# EAGLE design untitled (EAGLE 7.2.0)

## Sheet 1 of 2
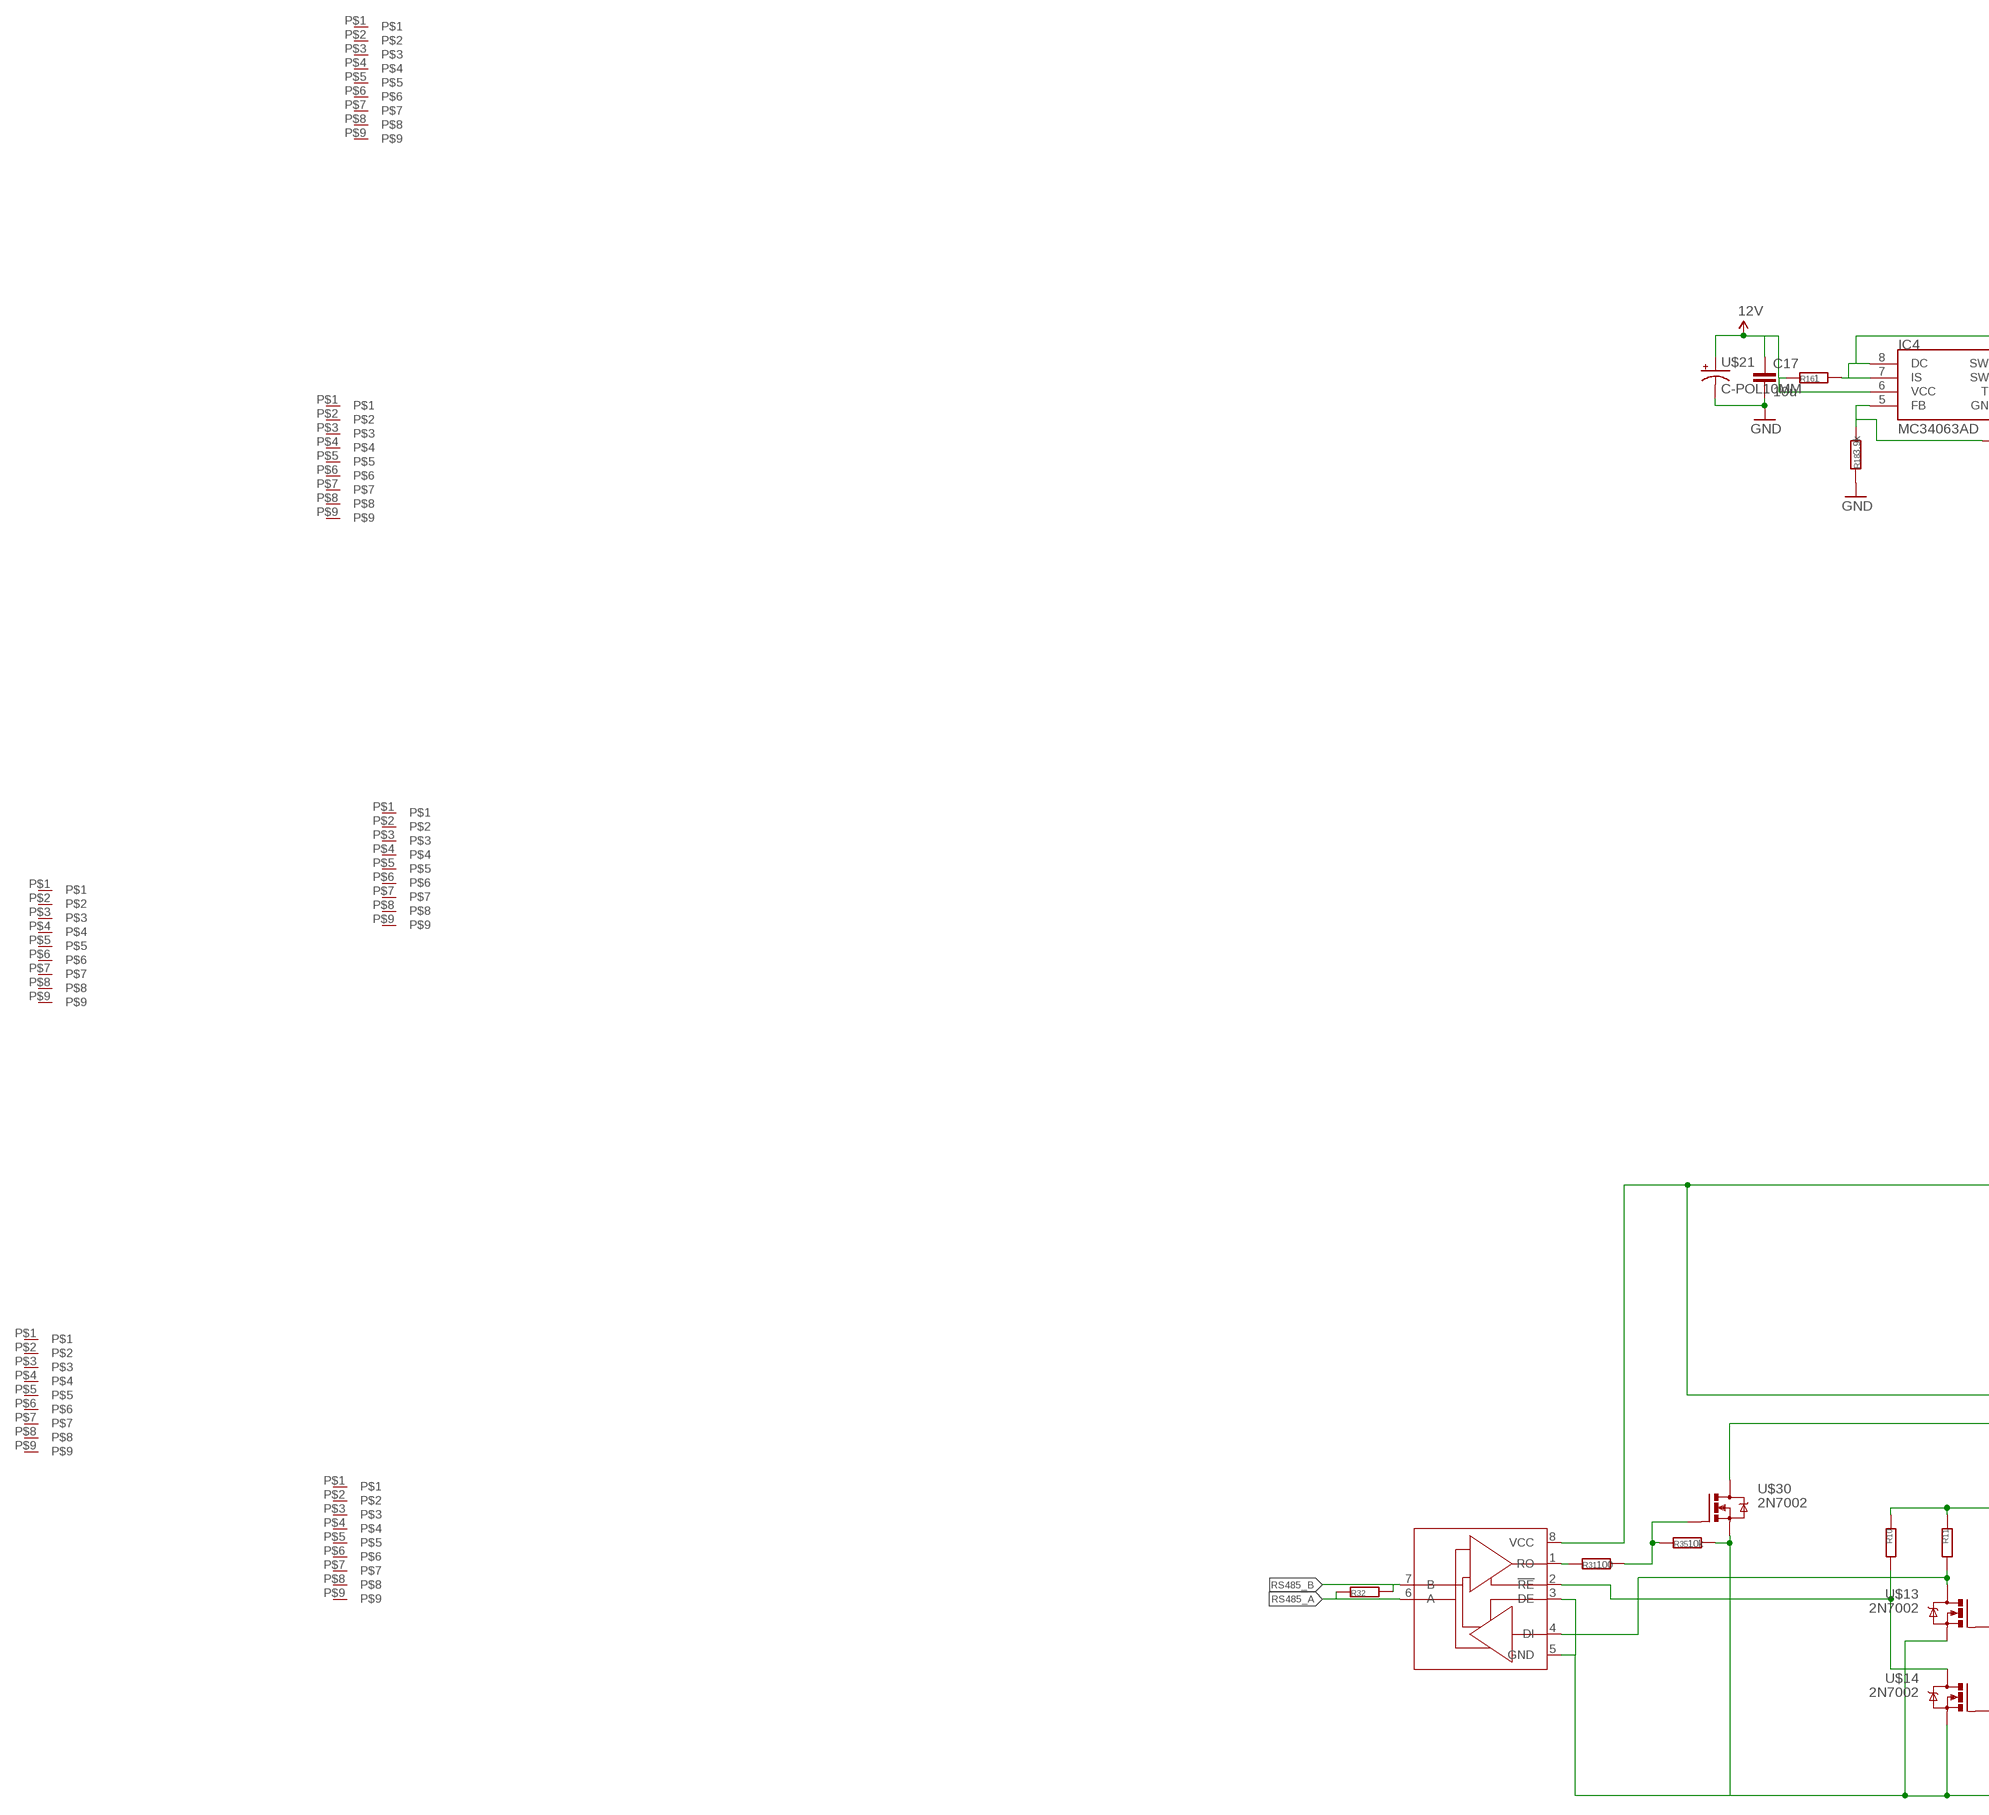
[diagram p0: schematic, sheet 1, part 1 of 2]
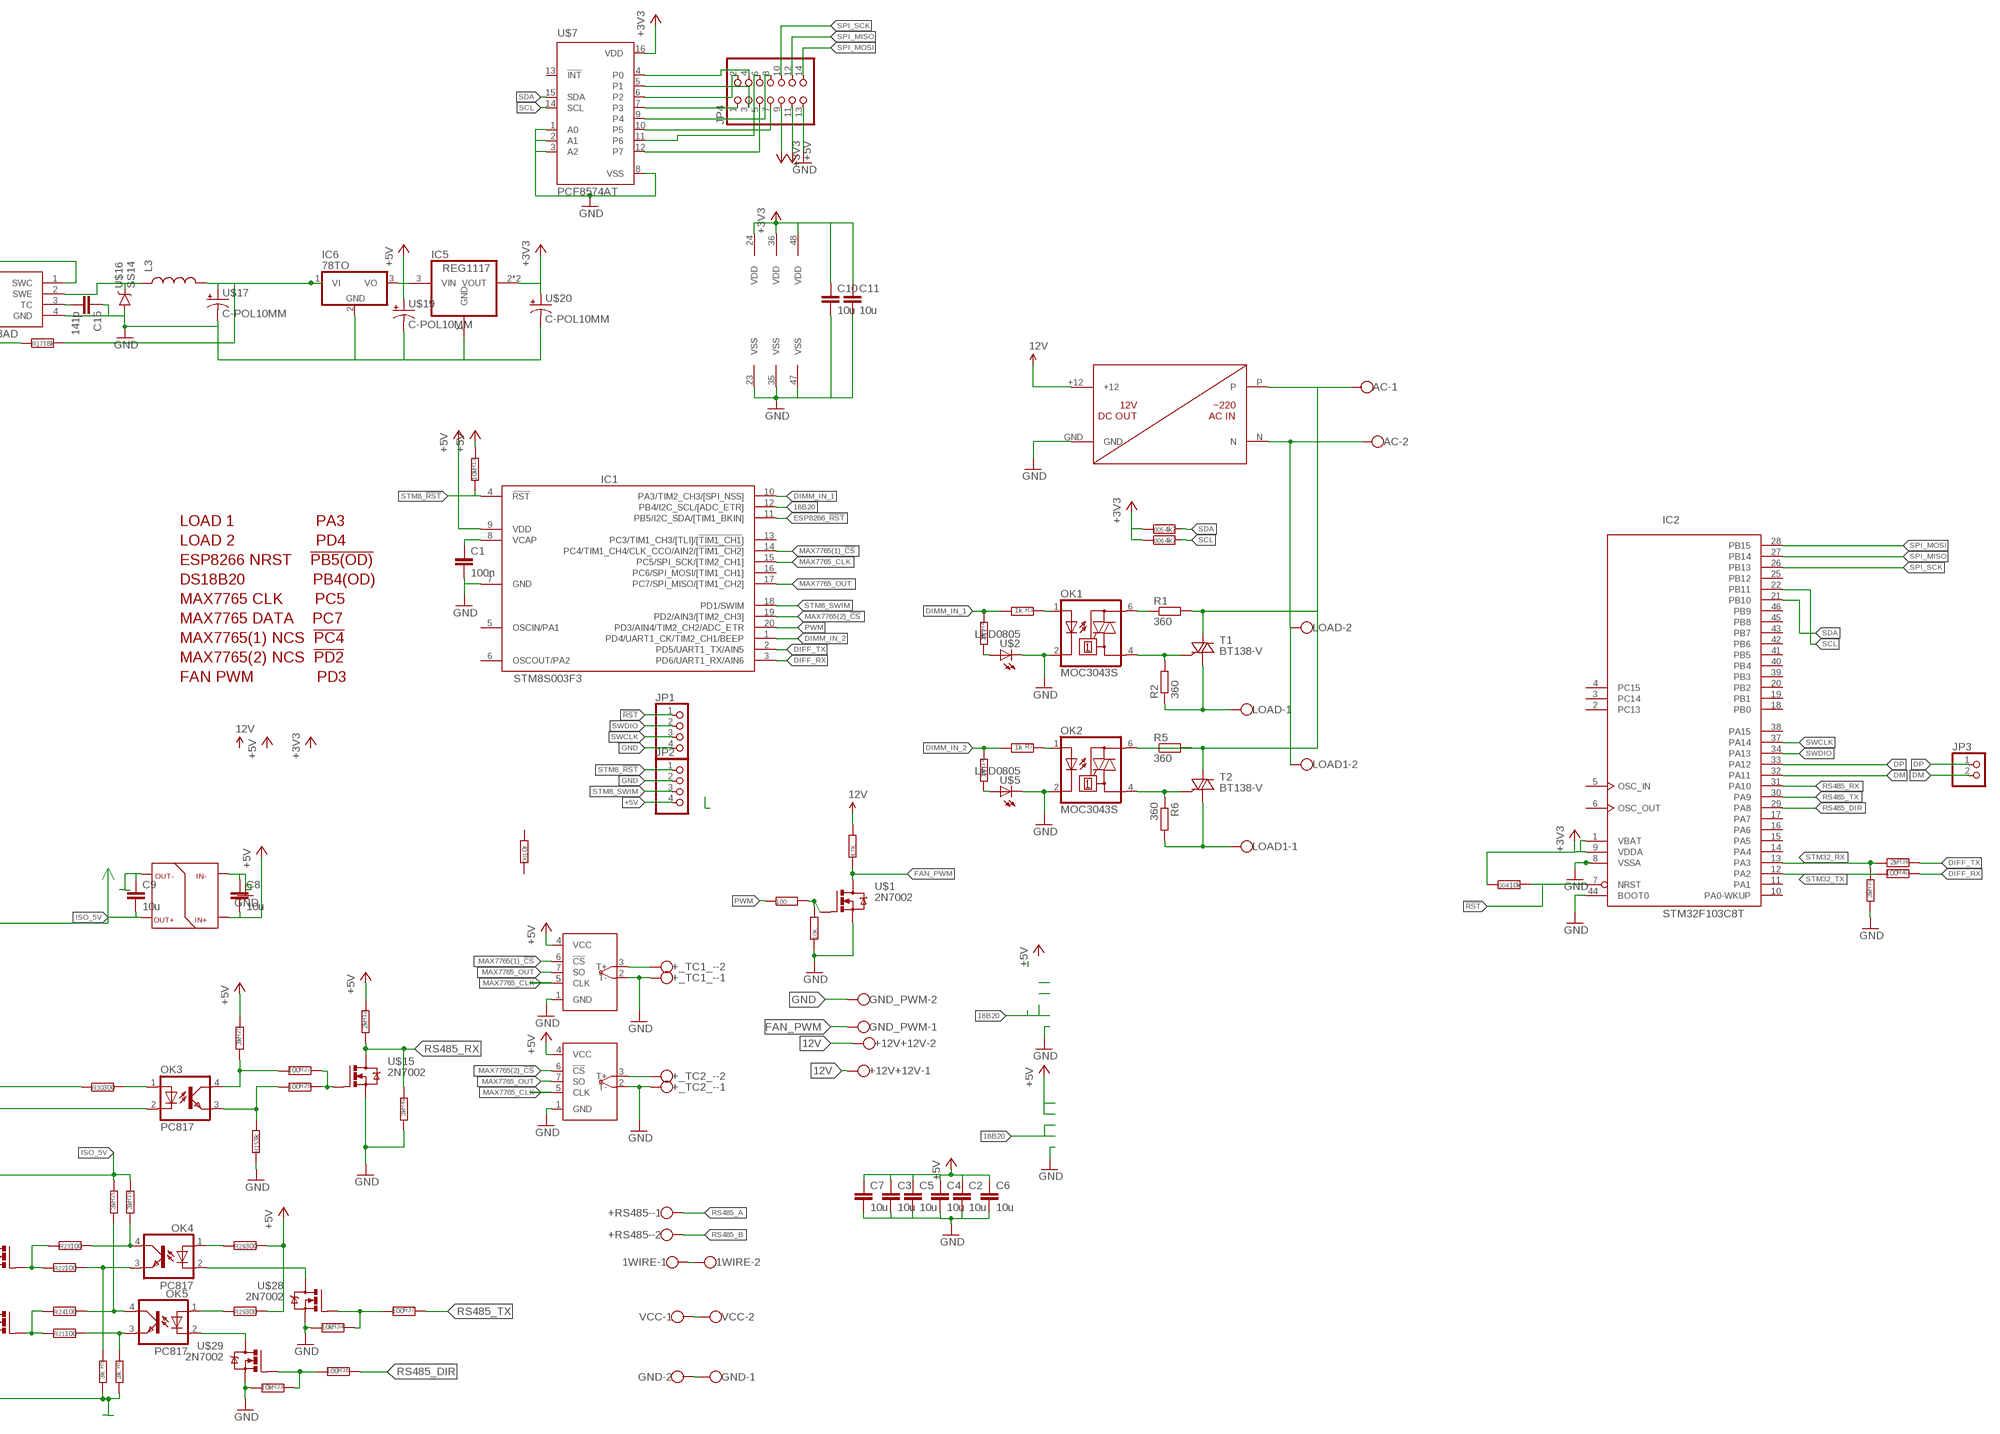
[diagram p1: schematic, sheet 1, part 2 of 2]

### Parts
001  0r  R0603  [0603]
1WIRE  W237-102  [W237-102]
004  10k  R0603  [0603]
4.7K  R0603  [0603]
005  4k7  R0603  [0603]
006  4k7  R0603  [0603]
10K  R0603  [0603]
100  R0603  [0603]
+12V+12V  W237-102  [W237-102]
+_TC1_-  W237-102  [W237-102]
+_TC2_-  W237-102  [W237-102]
+RS485-  W237-102  [W237-102]
AC  W237-102  [W237-102]
C1  100n  CC0603  [C0603]
C2  10u  CC0805  [C0805]
C3  10u  CC0805  [C0805]
C4  10u  CC0805  [C0805]
C5  10u  CC0805  [C0805]
C6  10u  CC0805  [C0805]
C7  10u  CC0805  [C0805]
C8  10u  CC0805  [C0805]
C9  10u  CC0805  [C0805]
C10  10u  CC0603  [C0603]
C11  10u  CC0603  [C0603]
C15  141p  CC0603  [C0603]
C17  10u  CC0805  [C0805]
GND  W237-102  [W237-102]
GND_PWM  W237-102  [W237-102]
IC1  STM8S003F3  [TSSOP20]
IC2  STM32F103C8T  [LQFP48]
IC4  MC34063AD  [SOIC8]
IC5  REG1117  [SOT223]
IC6  78TO  [D2PACK]
JP1  PINHD-1X4  [1X04]
JP2  PINHD-1X4  [1X04]
JP3  PINHD-1X02_2.00  [1X02M]
JP4  PINHD-2X07_2.54-SMD  [2X07SMD]
L3  INDUCTORSRU1038  [SRU1038]
LOAD  W237-102  [W237-102]
LOAD1  W237-102  [W237-102]
OK1  MOC3043S  [DIL6-SMD]
OK2  MOC3043S  [DIL6-SMD]
OK3  PC817  [DIL4-SMD]
OK4  PC817  [DIL4-SMD]
OK5  PC817  [DIL4-SMD]
R1  360  R-EU_0207/5V  [0207/5V]
R2  360  R-EU_0207/5V  [0207/5V]
R3  1k  R0603  [0603]
R4  1k  R0603  [0603]
R5  360  R-EU_0207/5V  [0207/5V]
R6  360  R-EU_0207/5V  [0207/5V]
R7  1k  R0603  [0603]
R8  3k  R0603  [0603]
R9  3k  R0603  [0603]
R10  R0603  [0603]
R11  R0603  [0603]
R12  2k  R0603  [0603]
R13  10k  R0603  [0603]
R14  1k  R0603  [0603]
R15  3k  R0603  [0603]
R16  1  R0805  [R0805]
R17  18k  R0603  [0603]
R18  3.9k  R0603  [0603]
R19  3k  R0603  [0603]
R20  3k  R0603  [0603]
R21  100  R0603  [0603]
R22  100  R0603  [0603]
R23  100  R0603  [0603]
R24  100  R0603  [0603]
R25  3k  R0603  [0603]
R26  100  R0603  [0603]
R27  100  R0603  [0603]
R28  300  R0603  [0603]
R29  300  R0603  [0603]
R30  300  R0603  [0603]
R31  100  R0603  [0603]
R32  R0805  [R0805]
R33  10k  R0603  [0603]
R34  10k  R0603  [0603]
R35  10k  R0603  [0603]
R36  100  R0603  [0603]
R37  100  R0603  [0603]
R38  2k  R0603  [0603]
R39  3k  R0603  [0603]
R40  100  R0603  [0603]
R41  3k  R0603  [0603]
T1  BT138-V  [TO220BV]
T2  BT138-V  [TO220BV]
U$1  2N7002  [SOT23]
U$2  LED0805  [0805-LED]
U$3  MAX6675  [SO08]
U$4  ADM1485  [SO08]
U$5  LED0805  [0805-LED]
U$6  MAX6675  [SO08]
U$7  PCF8574AT  [SO16L]
U$8  AC-DC  [ACDC12(1)]
U$12  DCDC5050  [DCDC/0505]
U$13  2N7002  [SOT23]
U$14  2N7002  [SOT23]
U$15  2N7002  [SOT23]
U$16  SS14  [SMA-DIODE]
U$17  C-POL10MM  [PCAP10]
U$19  C-POL10MM  [PCAP10]
U$20  C-POL10MM  [PCAP10]
U$21  C-POL10MM  [PCAP10]
U$22  D9MG  [D9MG]
U$23  D9MG  [D9MG]
U$24  D9MG  [D9MG]
U$25  D9MG  [D9MG]
U$26  D9MG  [D9MG]
U$27  D9MG  [D9MG]
U$28  2N7002  [SOT23]
U$29  2N7002  [SOT23]
U$30  2N7002  [SOT23]
VCC  W237-102  [W237-102]

### Nets
12V: 4.7K.2 +12V+12V.1 +12V+12V.2 C17.1 IC4.6(VCC) R16.1 U$8.+12 U$21.P$1(+)
18B20: 1WIRE.1 1WIRE.2 IC1.12(PB4/I2C_SCL/[ADC_ETR])
!RST: 004.2 IC2.7(NRST) JP1.1
+3V3: 004.1 005.1 006.1 C10.1 C11.1 IC2.1(VBAT) IC2.9(VDDA) IC2.24(VDD) IC2.36(VDD) IC2.48(VDD) IC5.2(VOUT) IC5.4(VOUT) JP4.9 U$7.16(VDD) U$20.P$1(+)
+5V: C2.1 C3.1 C4.1 C5.1 C6.1 C7.1 C8.2 IC1.9(VDD) IC5.3(VIN) IC6.3(VO) JP2.4 JP4.11 R12.1 R13.1 R25.1 R28.2 R29.2 U$3.4(VCC) U$6.4(VCC) U$12.P$2(IN+) U$19.P$1(+) VCC.1 VCC.2
+7V: IC6.1(VI) L3.2 R17.2 U$17.P$1(+)
DIFF_RX: IC1.3(PD6/UART1_RX/AIN6) R40.1
DIFF_TX: IC1.2(PD5/UART1_TX/AIN5) R38.1
DIMM_IN_1: IC1.10(PA3/TIM2_CH3/[SPI_NSS]) R3.2 R4.1
DIMM_IN_2: IC1.1(PD4/UART1_CK/TIM2_CH1/BEEP) R7.2 R14.1
DM: IC2.32(PA11) JP3.2
DP: IC2.33(PA12) JP3.1
ESP8266_!RST: IC1.11(PB5/I2C_SDA/[TIM1_BKIN])
FAN_PWM: 4.7K.1 GND_PWM.1 U$1.3(D)
GND: 10K.1 +_TC1_-.1 +_TC2_-.1 C1.2 C2.2 C3.2 C4.2 C5.2 C6.2 C7.2 C8.1 C10.2 C11.2 C15.1 C17.2 GND.1 GND.2 GND_PWM.2 IC1.7(GND) IC2.8(VSSA) IC2.23(VSS) IC2.35(VSS) IC2.44(BOOT0) IC2.47(VSS) IC4.4(GND) IC5.1(GND) IC6.2(GND) JP1.4 JP2.2 JP4.13 OK1.2(C) OK2.2(C) R15.1 R18.1 R33.2 R34.2 R39.2 R41.2 U$1.2(S) U$2.C U$3.1(GND) U$3.2(T-) U$5.C U$6.1(GND) U$6.2(T-) U$7.1(A0) U$7.2(A1) U$7.3(A2) U$7.8(VSS) U$8.GND U$12.P$1(IN-) U$15.2(S) U$16.A U$17.P$2(-) U$19.P$2(-) U$20.P$2(-) U$21.P$2(-) U$28.2(S) U$29.2(S)
ISO_5V: C9.2 R10.1 R11.1 R19.1 R20.1 R30.1 U$4.8(VCC) U$12.P$5(OUT+)
ISO_GND: C9.1 R8.2 R9.2 R35.2 U$4.3(DE) U$4.5(GND) U$12.P$4(OUT-) U$13.2(S) U$14.2(S) U$30.2(S)
MAX7765(1)_!CS: IC1.14(PC4/TIM1_CH4/CLK_CCO/AIN2/[!TIM1_CH2!]) U$3.6(!CS)
MAX7765(2)_!CS: IC1.19(PD2/AIN3/[TIM2_CH3]) U$6.6(!CS)
MAX7765_CLK: IC1.15(PC5/SPI_SCK/[TIM2_CH1]) U$3.5(CLK) U$6.5(CLK)
MAX7765_OUT: IC1.17(PC7/SPI_MISO/[TIM1_CH2]) U$3.7(SO) U$6.7(SO)
N$1: +_TC1_-.2 U$3.3(T+)
N$2: OK1.1(A) R3.1
N$3: R4.2 U$2.A
N$4: 10K.2 100.2 U$1.1(G)
N$6: JP4.4 U$7.4(P0)
N$7: OK1.4(A1) R2.2 T1.G
N$8: OK1.6(A2) R1.1
N$9: +_TC2_-.2 U$6.3(T+)
N$11: AC.2 LOAD1.2 LOAD.2 U$8.N
N$12: LOAD.1 R2.1 T1.T1(A1)
N$15: OK2.4(A1) R6.1 T2.G
N$16: OK2.6(A2) R5.2
N$17: JP4.3 U$7.5(P1)
N$18: JP4.2 U$7.6(P2)
N$19: JP4.1 U$7.7(P3)
N$20: JP4.8 U$7.9(P4)
N$21: JP4.7 U$7.10(P5)
N$22: JP4.6 U$7.11(P6)
N$23: JP4.5 U$7.12(P7)
N$25: OK4.3(EMIT) R9.1 R22.2
N$26: AC.1 R1.2 R5.1 T1.T2(A2) T2.T2(A2) U$8.P
N$27: OK5.3(EMIT) R8.1 R21.2
N$28: C1.1 IC1.8(VCAP)
N$29: LOAD1.1 R6.2 T2.T1(A1)
N$33: OK2.1(A) R7.1
N$34: R14.2 U$5.A
N$36: R10.2 U$4.2(!RE) U$14.3(D)
N$37: R11.2 U$4.4(DI) U$13.3(D)
N$38: OK3.4(COL) R25.2 R27.2
N$40: OK3.3(EMIT) R15.2 R26.2
N$42: C15.2 IC4.3(TC)
N$43: IC4.2(SWE) L3.1 U$16.C
N$44: IC4.5(FB) R17.1 R18.2
N$45: IC4.1(SWC) IC4.7(IS) IC4.8(DC) R16.2
N$46: OK5.4(COL) R20.2 R24.2
N$47: OK4.4(COL) R19.2 R23.2
N$48: R22.1 R23.1 U$13.1(G)
N$49: R21.1 R24.1 U$14.1(G)
N$50: R26.1 R27.1 U$15.1(G)
N$51: OK4.2(C) U$28.3(D)
N$52: OK3.1(A) R30.2
N$53: OK3.2(C) U$30.3(D)
N$54: OK4.1(A) R28.1
N$55: R31.1 U$4.1(RO)
N$56: OK5.1(A) R29.1
N$57: OK5.2(C) U$29.3(D)
N$62: R31.2 R35.1 U$30.1(G)
PWM: 100.1 IC1.20(PD3/AIN4/TIM2_CH2/ADC_ETR)
RS485_A: +RS485-.1 R32.1 U$4.6(A)
RS485_B: +RS485-.2 R32.2 U$4.7(B)
RS485_DIR: IC2.29(PA8) R36.1
RS485_RX: IC2.31(PA10) R12.2 R41.1 U$15.3(D)
RS485_TX: IC2.30(PA9) R37.1
SCL: 006.2 IC2.22(PB11) U$7.14(SCL)
SDA: 005.2 IC2.21(PB10) U$7.15(SDA)
SPI_MISO: IC2.27(PB14) JP4.12
SPI_MOSI: IC2.28(PB15) JP4.14
SPI_SCK: IC2.26(PB13) JP4.10
STM8_!RST: IC1.4(!RST) JP2.1 R13.2
STM8_SWIM: IC1.18(PD1/SWIM) JP2.3
STM32_RX: IC2.13(PA3) R38.2 R39.1
STM32_TX: IC2.12(PA2) R40.2
SWCLK: IC2.37(PA14) JP1.3
SWDIO: IC2.34(PA13) JP1.2
~RS485_DIR: R33.1 R36.2 U$29.1(G)
~RS485_TX: R34.1 R37.2 U$28.1(G)
Unconnected: 001.1 001.2 IC1.5(OSCIN/PA1) IC1.6(OSCOUT/PA2) IC1.13(PC3/TIM1_CH3/[TLI]/[!TIM1_CH1!]) IC1.16(PC6/SPI_MOSI/[TIM1_CH1]) IC2.2(PC13) IC2.3(PC14) IC2.4(PC15) IC2.5(OSC_IN) IC2.6(OSC_OUT) IC2.10(PA0-WKUP) IC2.11(PA1) IC2.14(PA4) IC2.15(PA5) IC2.16(PA6) IC2.17(PA7) IC2.18(PB0) IC2.19(PB1) IC2.20(PB2) IC2.25(PB12) IC2.38(PA15) IC2.39(PB3) IC2.40(PB4) IC2.41(PB5) IC2.42(PB6) IC2.43(PB7) IC2.45(PB8) IC2.46(PB9) U$7.13(!INT) U$22.P$1 U$22.P$2 U$22.P$3 U$22.P$4 U$22.P$5 U$22.P$6 U$22.P$7 U$22.P$8 U$22.P$9 U$23.P$1 U$23.P$2 U$23.P$3 U$23.P$4 U$23.P$5 U$23.P$6 U$23.P$7 U$23.P$8 U$23.P$9 U$24.P$1 U$24.P$2 U$24.P$3 U$24.P$4 U$24.P$5 U$24.P$6 U$24.P$7 U$24.P$8 U$24.P$9 U$25.P$1 U$25.P$2 U$25.P$3 U$25.P$4 U$25.P$5 U$25.P$6 U$25.P$7 U$25.P$8 U$25.P$9 U$26.P$1 U$26.P$2 U$26.P$3 U$26.P$4 U$26.P$5 U$26.P$6 U$26.P$7 U$26.P$8 U$26.P$9 U$27.P$1 U$27.P$2 U$27.P$3 U$27.P$4 U$27.P$5 U$27.P$6 U$27.P$7 U$27.P$8 U$27.P$9

### Notes on the sheet
- LOAD 1                  PA3
  LOAD 2                  PD4
  ESP8266 NRST    !PB5(OD)
  DS18B20               PB4(OD)
  MAX7765 CLK       PC5
  MAX7765 DATA    PC7
  MAX7765(1) NCS  !PC4
  MAX7765(2) NCS  !PD2
  FAN PWM              PD3

## Sheet 2 of 2
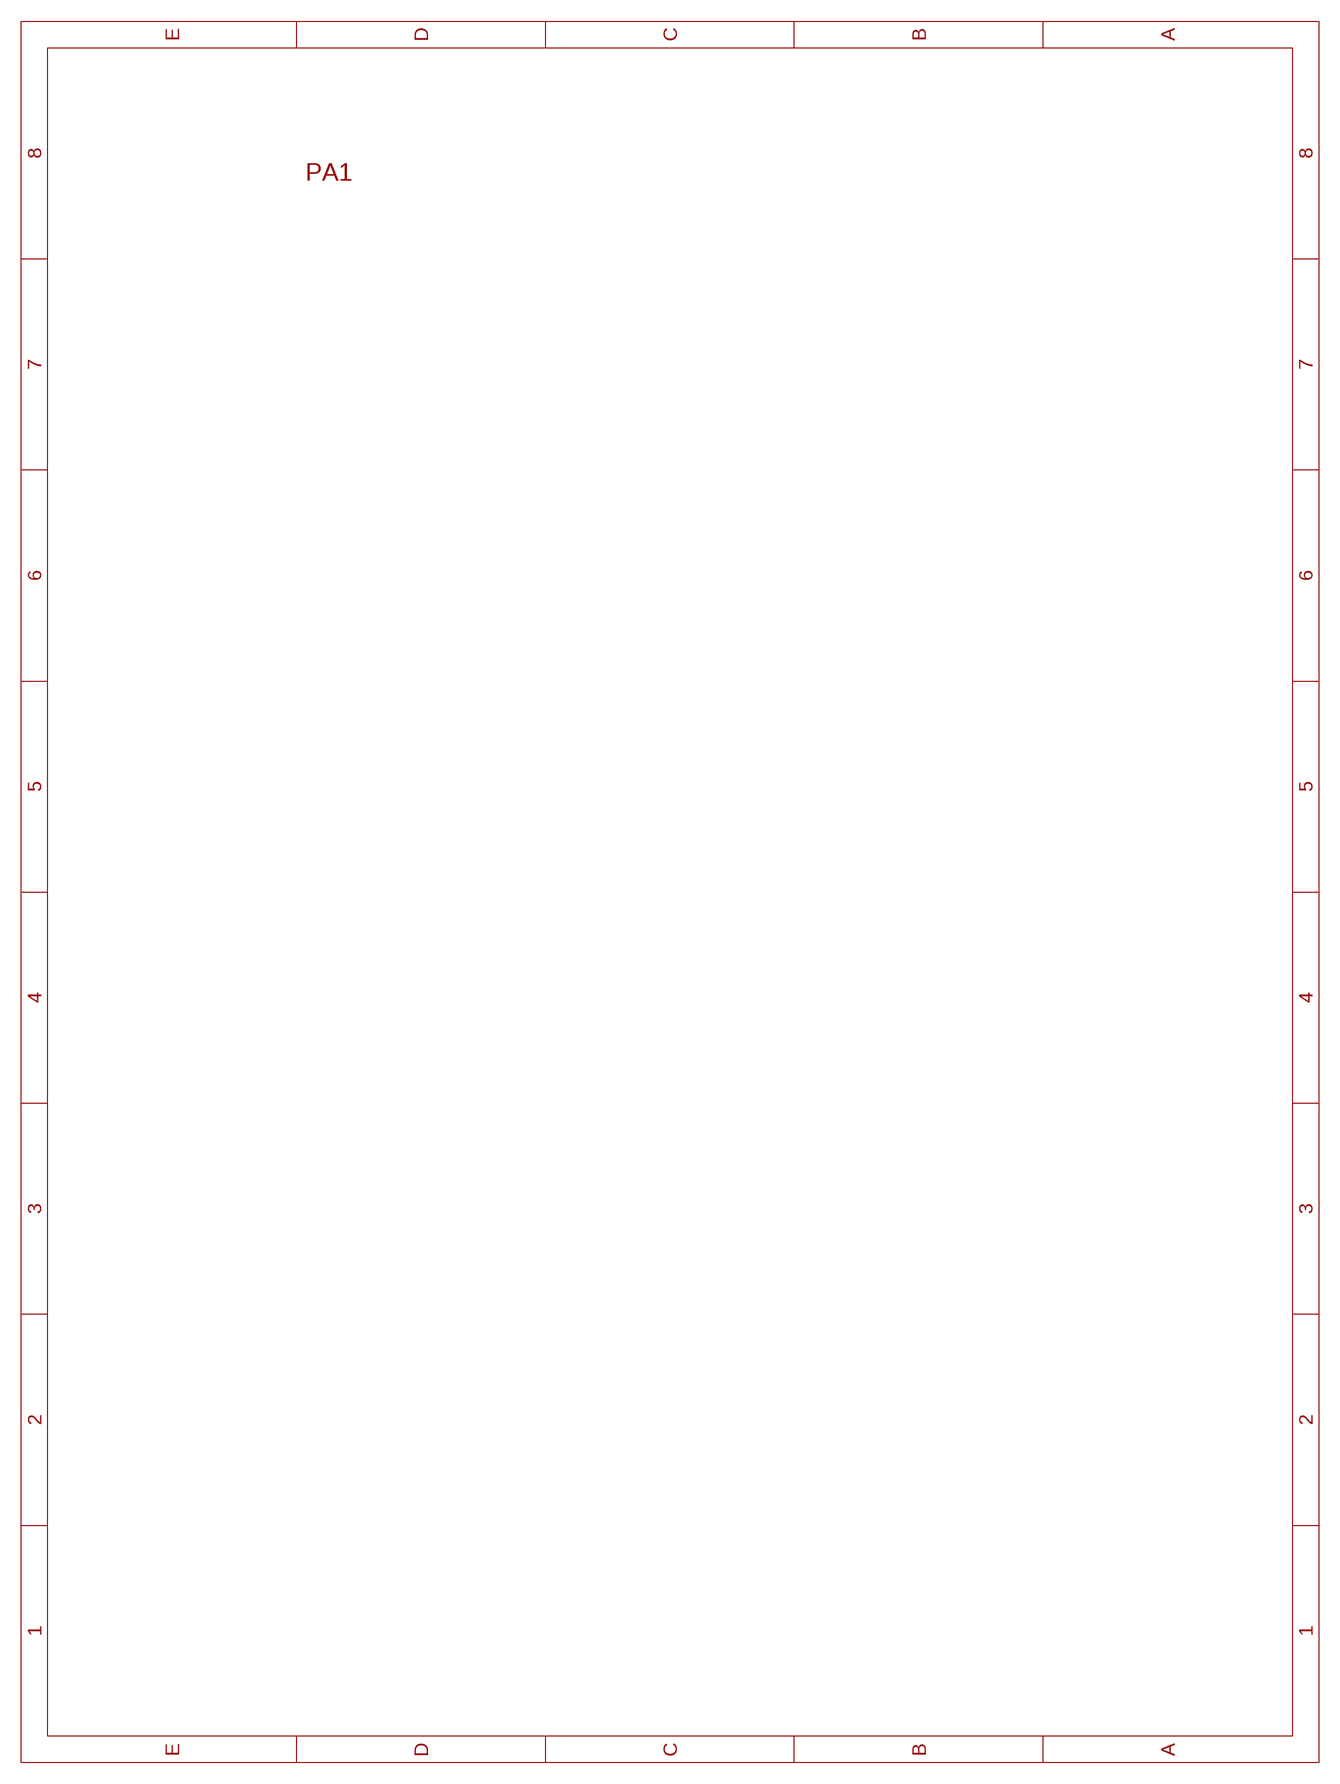
[diagram p2: schematic, sheet 2]

### Notes on the sheet
- PA1

## Library data of the parts
001 004 4.7K 005 006 10K 100 R3 R4 R7-R41 = CasaLibrary:R
1WIRE +12V+12V +_TC1_- +_TC2_- +RS485- AC GND GND_PWM LOAD LOAD1 VCC = con-wago-500:W237-102: WAGO SCREW CLAMP; MPN: 237-102; OC_FARNELL: unknown; OC_NEWARK: 70K9898
C1-C11 C15 C17 = CasaLibrary:C: Capacitor
IC1 = CasaLibrary:STM8S003: Value line, 16 MHz STM8S 8-bit MCU, 8 Kbytes Flash, 128 bytes data EEPROM, 10-bit ADC, 3 timers, UART, SPI, I2C
IC2 = micro-stm_v3:STM32F103C*T: ARM 32-bit Cortex™-M3 CPU 72 MHz maximum frequency 16 to 128 Kbytes of Flash memory 6 to 20 kbytes of SRAM 37 GPIOs 2.0 to 3.6 V application supply
IC4 = CasaLibrary:MC34063
IC5 = burr-brown:REG1117: 800mA and 1A Low Dropout (LDO) Positive Regulator 1.8V, 2.5V, 2.85V, 3.3V, 5V, and Adj; MPN: REG1117; OC_FARNELL: 1097566; OC_NEWARK: 14P6981
IC6 = linear:78*: Positive VOLTAGE REGULATOR Source: http://cache.national.com/ds/LM/LM78L05.pdf http://www.fairchildsemi.com/ds/LM/LM7805.pdf
JP1 JP2 = pinhead:PINHD-1X4: PIN HEADER
JP3 = pinhead-2:PINHD-1X02: PIN HEADER
JP4 = pinhead-2:PINHD-2X07: PIN HEADER
L3 = SparkFun-Passives:INDUCTOR: Inductors Basic Inductor/Choke - 0603 and 1206. Footprints are not proven and vary greatly between part numbers. INDUCTOR POWER 3.3UH 4.0A SMD 0.197" L x 0.197" W x 0.177" H (5.00mm x 5.00mm x 4.50mm)
OK1 OK2 = optocoupler:MOC30*: 6-Pin DIP Zero-Cross Optoisolators Triac Driver Output (250/400 Volt Peak) Source: Data sheet <http://www.fairchildsemi.com/ds/MO/MOC3031M.pdf> The old path of data sheet not more available 2013-05-06.; MF: FAIRCHILD SEMICONDUCTOR; MPN: MOC3043SM; OC_FARNELL: 1505441; OC_NEWARK: 78K6091
OK3-OK5 = CasaLibrary:PC817
R1 R2 R5 R6 = rcl:R-EU_: RESISTOR, European symbol
T1 T2 = triac:BT138: TRIAC Source: http://www.semiconductors.philips.com BT138_SERIES_2.pdf
U$1 U$13-U$15 U$28-U$30 = CasaLibrary:2N7002
U$2 U$5 = CasaLibrary:LED
U$3 U$6 = CasaLibrary:MAX6675
U$4 = CasaLibrary:ADM1485
U$7 = CasaLibrary:PCF8574AT
U$8 = CasaLibrary:AC-DC
U$12 = CasaLibrary:DCDC5050
U$16 = CasaLibrary:SS14
U$17 U$19-U$21 = CasaLibrary:C-POL
U$22-U$27 = CasaLibrary:D9MG

## Board
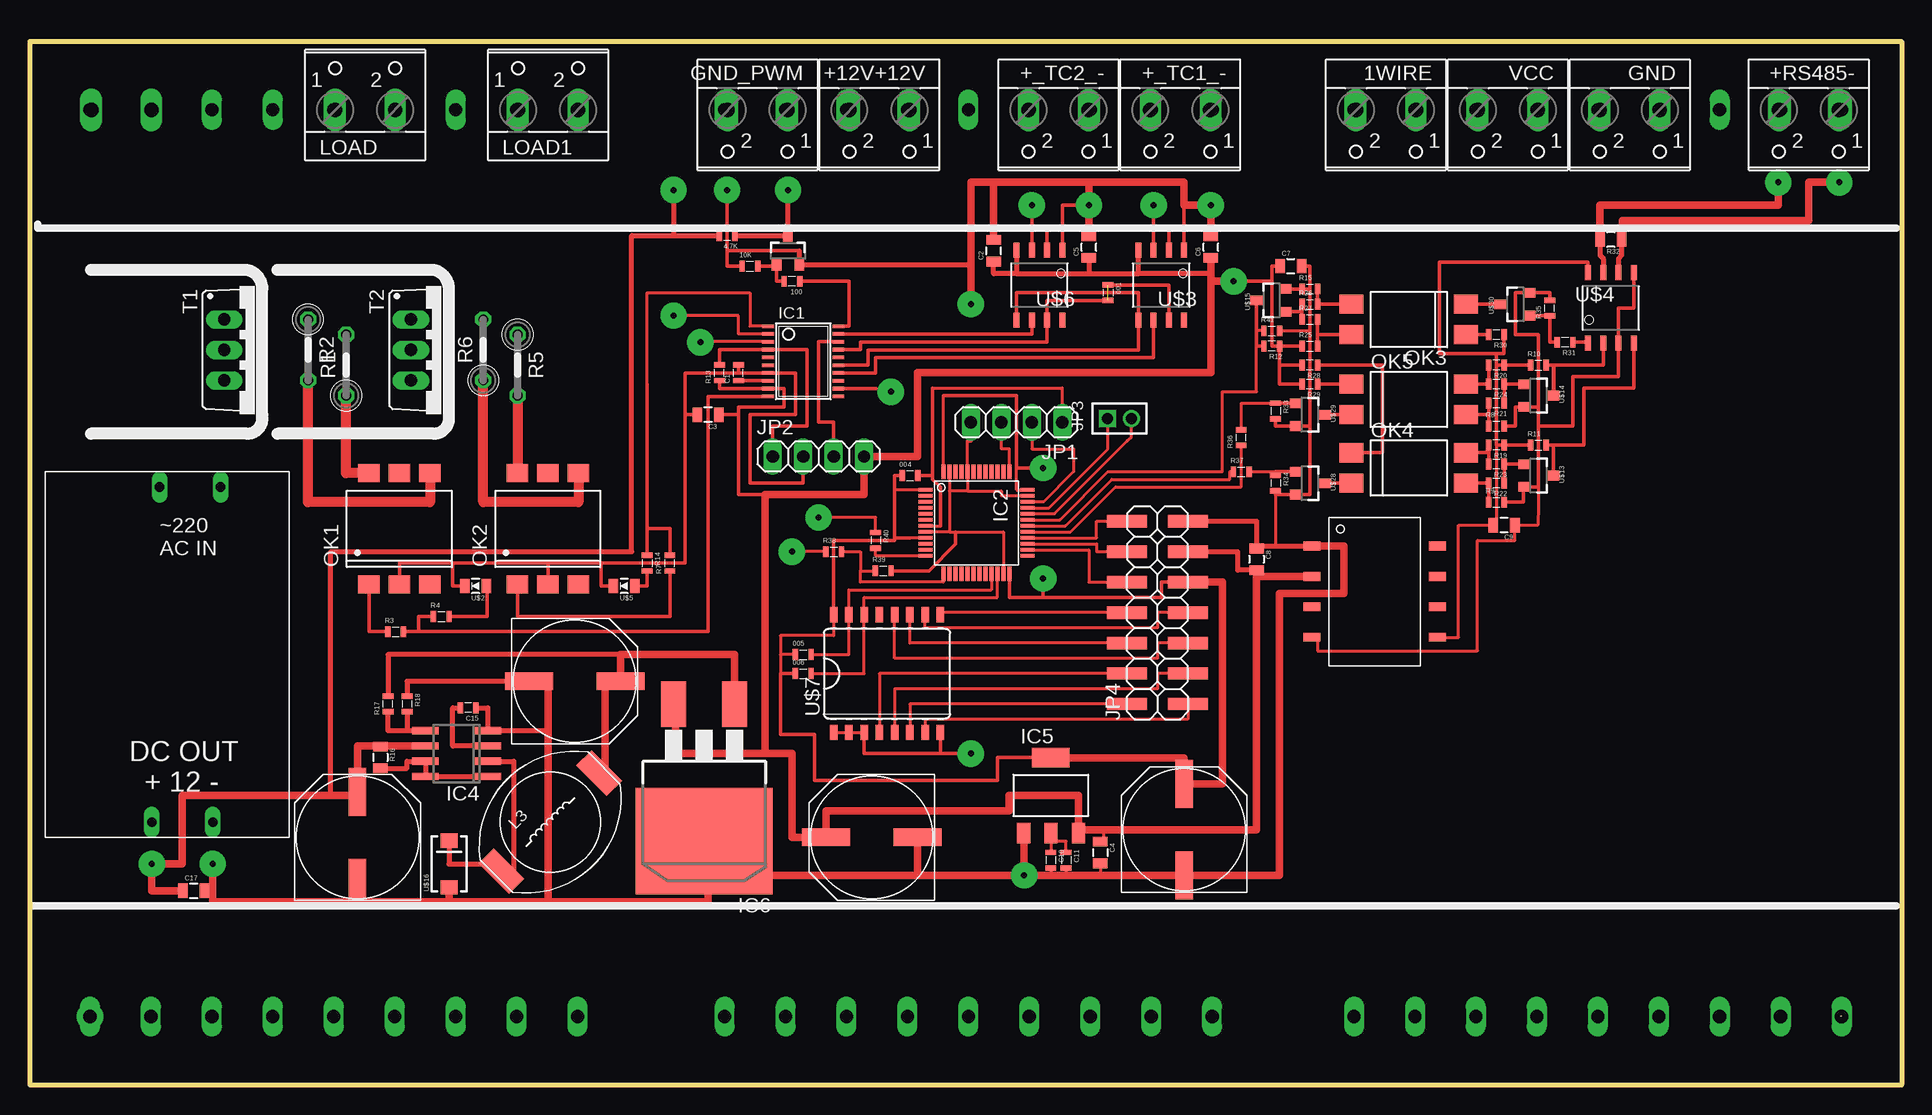
[diagram p3: board, top side]
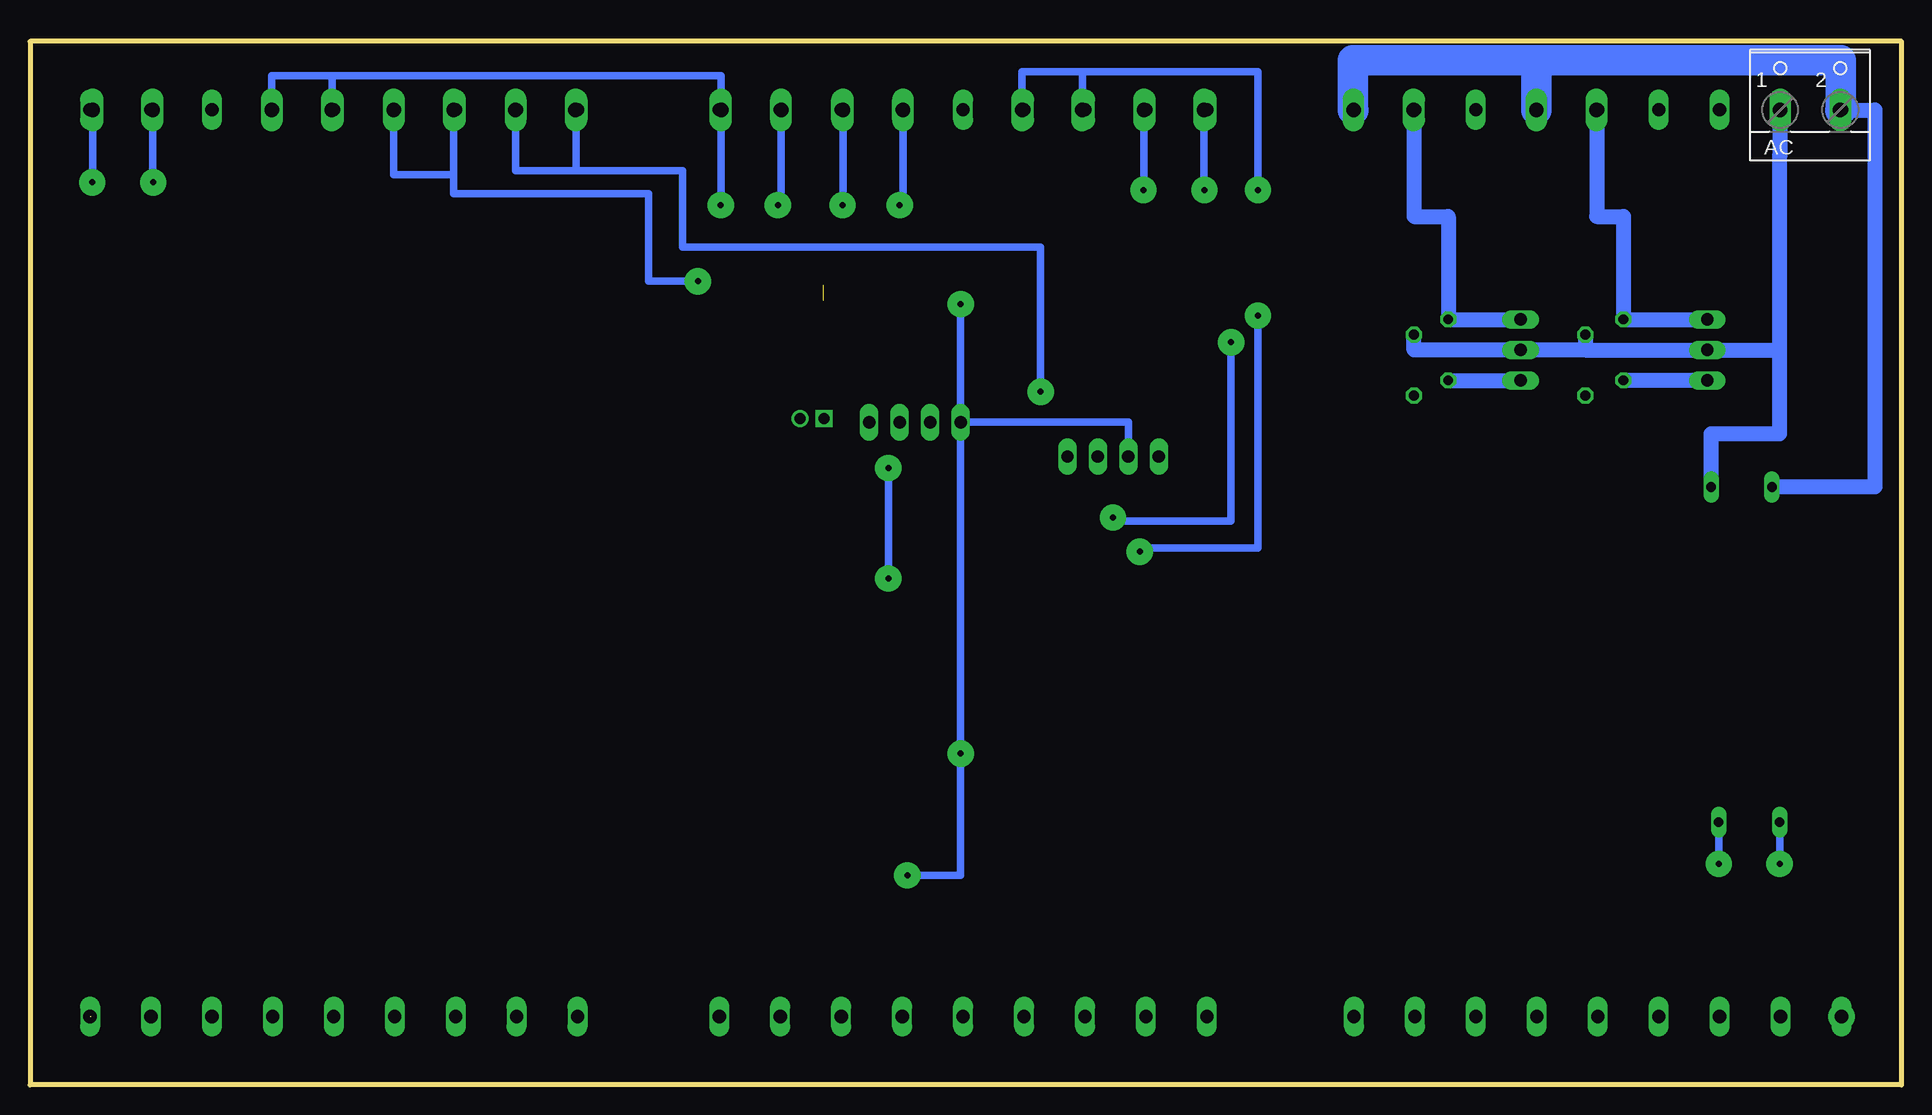
[diagram p4: board, bottom side, seen from below]

Size 156 x 87 mm. Coordinates in mm from the lower left corner, seen from the top.
Outline: 151,5.7 150.9,5.7
Outline: 0,0 156,0 156,87 0,87 0,0
Copper layers (1*16): Top 0.035mm / dielectric 1.5mm / Bottom 0.035mm
Design rules "my02": minimum track width 0.2mm, minimum drill 0.2mm, track to track 0.2mm, track to pad 0.2mm, pad to pad 0.2mm, via to via 0.2mm, smd to smd 0.2mm, copper to edge 40mil, drill to drill 8mil, minimum pad ring 10mil, minimum via ring 8mil, stop-mask expansion 4mil, vias tented up to drill 0mil, thermal gap 10mil
bKeepout: 3 lines

### Footprints (pad centres in the part's own frame; a part is rotated, then mirrored left to right if it is on the bottom)
0603 = smd 0.45 x 0.9: 1 -0.65,0; 2 0.65,0
W237-102 = drill 1.194 long: 1 -2.5,-1.27; 2 2.5,-1.27
C0603 = smd 0.45 x 0.9: 1 -0.65,0; 2 0.65,0
C0805 = smd 0.8 x 1.2: 1 -0.9,0; 2 0.9,0
TSSOP20 = smd 0.305 x 0.991: 1 -2.925,-2.918; 2 -2.275,-2.918; 3 -1.625,-2.918; 4 -0.975,-2.918; 5 -0.325,-2.918; 6 0.325,-2.918; 7 0.975,-2.918; 8 1.625,-2.918; 9 2.275,-2.918; 10 2.925,-2.918; 11 2.925,2.918; 12 2.275,2.918; 13 1.625,2.918; 14 0.975,2.918; 15 0.325,2.918; 16 -0.325,2.918; 17 -0.975,2.918; 18 -1.625,2.918; 19 -2.275,2.918; 20 -2.925,2.918
LQFP48 = smd 0.3 x 1.2: 1 -2.75,-4.25; 2 -2.25,-4.25; 3 -1.75,-4.25; 4 -1.25,-4.25; 5 -0.75,-4.25; 6 -0.25,-4.25; 7 0.25,-4.25; 8 0.75,-4.25; 9 1.25,-4.25; 10 1.75,-4.25; 11 2.25,-4.25; 12 2.75,-4.25; 25 2.75,4.25; 26 2.25,4.25; 27 1.75,4.25; 28 1.25,4.25; 29 0.75,4.25; 30 0.25,4.25; 31 -0.25,4.25; 32 -0.75,4.25; 33 -1.25,4.25; 34 -1.75,4.25; 35 -2.25,4.25; 36 -2.75,4.25 | smd 1.2 x 0.3: 13 4.25,-2.75; 14 4.25,-2.25; 15 4.25,-1.75; 16 4.25,-1.25; 17 4.25,-0.75; 18 4.25,-0.25; 19 4.25,0.25; 20 4.25,0.75; 21 4.25,1.25; 22 4.25,1.75; 23 4.25,2.25; 24 4.25,2.75; 37 -4.25,2.75; 38 -4.25,2.25; 39 -4.25,1.75; 40 -4.25,1.25; 41 -4.25,0.75; 42 -4.25,0.25; 43 -4.25,-0.25; 44 -4.25,-0.75; 45 -4.25,-1.25; 46 -4.25,-1.75; 47 -4.25,-2.25; 48 -4.25,-2.75
SOIC8 = smd 0.6 x 2.2: 1 -1.905,-2.6; 2 -0.635,-2.6; 3 0.635,-2.6; 4 1.905,-2.6; 5 1.905,2.6; 6 0.635,2.6; 7 -0.635,2.6; 8 -1.905,2.6
SOT223 = smd 1.1 x 1.7: 1 -2.261,-3.15; 2 0.025,-3.15; 3 2.311,-3.15 | smd 3.1 x 1.6: 4 0,3.15
D2PACK = smd 2.083 x 3.81: 1 -2.54,-8.89; 3 2.54,-8.89 | smd 11.43 x 8.89: 2 0,2.54
1X04 = drill 1.016 long: 1 -3.81,0; 2 -1.27,0; 3 1.27,0; 4 3.81,0
1X02M = drill 0.914 square: 1 -1,0 | drill 0.914: 2 1,0
2X07SMD = smd 1.016 x 3.302: 1 -1.27,-3.81; 2 -1.27,1.27; 3 1.27,-3.81; 4 1.27,1.27; 5 3.81,-3.81; 6 3.81,1.27; 7 6.35,-3.81; 8 6.35,1.27; 9 8.89,-3.81; 10 8.89,1.27; 11 11.43,-3.81; 12 11.43,1.27; 13 13.97,-3.81; 14 13.97,1.27
SRU1038 = smd 1.8 x 3.6: 1 -5.77,0; 2 5.77,0
DIL6-SMD = smd 1.78 x 1.52: 1 -2.54,-4.645; 2 0,-4.645; 3 2.54,-4.645; 4 2.54,4.645; 5 0,4.645; 6 -2.54,4.645
DIL4-SMD = smd 1.6 x 2: 1 -1.27,-4.77; 2 1.27,-4.77; 3 1.27,4.77; 4 -1.27,4.77
0207/5V = drill 0.813 octagon: 1 -2.54,0; 2 2.54,0
R0805 = smd 0.8 x 1.2: 1 -0.9,0; 2 0.9,0
TO220BV = drill 1.016 long: G 2.54,-2.54; T1 -2.54,-2.54; T2 0,-2.54
SOT23 = smd 0.8 x 1: 1 -0.95,-1.159; 2 0.95,-1.159; 3 0,1.259
0805-LED = smd 0.8 x 1.2: A -0.9,0; C 0.9,0
SO08 = smd 0.5 x 1.25: 1 -1.905,-2.934; 2 -0.635,-2.934; 3 0.635,-2.934; 4 1.905,-2.934; 5 1.905,2.934; 6 0.635,2.934; 7 -0.635,2.934; 8 -1.905,2.934
SO16L = smd 0.635 x 1.27: 1 -4.445,-4.902; 2 -3.175,-4.902; 3 -1.905,-4.902; 4 -0.635,-4.902; 5 0.635,-4.902; 6 1.905,-4.902; 7 3.175,-4.902; 8 4.445,-4.902; 9 4.445,4.902; 10 3.175,4.902; 11 1.905,4.902; 12 0.635,4.902; 13 -0.635,4.902; 14 -1.905,4.902; 15 -3.175,4.902; 16 -4.445,4.902
ACDC12(1) = drill 0.8 long: +12 8.89,1.27; GND 13.97,1.27; N 9.525,29.21; P 14.605,29.21
DCDC/0505 = smd 0.711 x 1.422: P$1 -3.969,-5.239; P$2 -1.429,-5.239; P$3 1.111,-5.239; P$4 3.651,-5.239; P$5 3.651,5.239; P$6 1.111,5.239; P$7 -1.429,5.239; P$8 -3.969,5.239
SMA-DIODE = smd 1.2 x 1.4: A -1.95,0; C 1.95,0
PCAP10 = smd 4 x 1.46: P$1 -3.81,0; P$2 3.81,0
D9MG = drill 1.1 pad 1.676 long: P$1 0,0; P$2 5.08,0; P$3 10.16,0; P$4 15.24,0; P$5 20.32,0; P$6 25.4,0; P$7 30.48,0; P$8 35.56,0; P$9 40.64,0

### Placement (x,y rotation side)
001  89.85,66.04 270 top
1WIRE  113.03,80.01 180 top
004  73.34,50.8 0 top
4.7K  58.1,70.8 180 top
005  64.45,35.88 0 top
006  64.45,34.29 0 top
10K  60.01,68.26 0 top
100  63.5,66.99 180 top
+12V+12V  70.8,80.01 180 top
+_TC1_-  95.88,80.01 180 top
+_TC2_-  85.72,80.01 180 top
+RS485-  148.27,80.01 180 top
AC  7.62,82.55 0 bottom
C1  59.05,59.37 90 top
C2  80.33,69.53 90 top
C3  56.51,55.88 180 top
C4  89.22,19.37 270 top
C5  88.26,69.85 90 top
C6  98.43,69.85 90 top
C7  105.09,68.26 0 top
C8  102.23,43.81 270 top
C9  122.87,46.67 180 top
C10  85.09,18.73 270 top
C11  86.36,18.73 270 top
C15  36.51,31.43 180 top
C17  13.65,16.19 0 top
GND  133.35,80.01 180 top
GND_PWM  60.64,80.01 180 top
IC1  64.45,60.32 270 top
IC2  78.89,46.86 270 top
IC4  35.56,27.62 90 top
IC5  85.09,24.13 0 top
IC6  56.2,22.86 180 top
JP1  82.23,55.24 180 top
JP2  65.72,52.39 0 top
JP3  90.81,55.56 0 top
JP4  92.71,33.02 90 top
L3  43.37,21.91 45 top
LOAD  27.94,82.55 0 top
LOAD1  43.18,82.55 0 top
OK1  30.8,46.35 0 top
OK2  43.18,46.35 0 top
OK3  114.94,63.82 90 top
OK4  114.94,51.44 270 top
OK5  114.94,57.15 270 top
R1  26.35,60.01 90 top
R2  23.18,61.28 270 top
R3  30.48,37.78 0 top
R4  34.29,39.05 0 top
R5  40.64,60.01 270 top
R6  37.78,61.28 90 top
R7  53.34,43.5 90 top
R8  122.24,54.93 0 top
R9  122.24,48.58 0 top
R10  125.73,60.01 0 top
R11  125.73,53.34 0 top
R12  103.5,61.59 180 top
R13  57.47,59.37 90 top
R14  51.43,43.5 270 top
R15  106.68,66.36 0 top
R16  29.21,27.3 270 top
R17  29.84,31.75 90 top
R18  31.43,31.75 270 top
R19  122.24,53.34 180 top
R20  122.24,60.01 180 top
R21  122.24,56.83 180 top
R22  122.24,50.16 180 top
R23  122.24,51.75 180 top
R24  122.24,58.42 180 top
R25  106.68,61.59 0 top
R26  106.68,65.09 0 top
R27  106.68,63.82 0 top
R28  106.68,60.01 180 top
R29  106.68,58.42 180 top
R30  122.24,62.55 180 top
R31  127.95,61.91 180 top
R32  131.76,70.48 180 top
R33  103.82,56.2 270 top
R34  103.82,50.16 270 top
R35  126.68,64.77 90 top
R36  100.97,53.97 90 top
R37  100.97,51.12 0 top
R38  66.99,44.45 0 top
R39  71.12,42.86 0 top
R40  70.48,45.4 270 top
R41  103.5,62.86 0 top
T1  18.73,61.28 270 top
T2  34.29,61.28 270 top
U$1  63.18,69.53 0 top
U$2  37.15,41.59 180 top
U$3  94.3,66.67 180 top
U$4  131.76,64.77 0 top
U$5  49.53,41.59 180 top
U$6  84.14,66.67 180 top
U$7  71.44,34.29 0 top
U$8  1.27,20.64 0 top
U$9  [HEATSINK]  34.93,55.88 90 top
U$10  [HEATSINK]  19.37,55.88 90 top
U$12  112.08,40.96 270 top
U$13  125.73,50.8 270 top
U$14  125.73,57.47 270 top
U$15  103.5,65.41 90 top
U$16  34.93,18.41 90 top
U$17  45.4,33.66 180 top
U$19  70.17,20.64 0 top
U$20  96.2,21.27 270 top
U$21  27.3,20.64 270 top
U$22  5,5.7 0 top
U$23  5,81.3 0 top
U$24  151,81.3 180 top
U$25  151,5.7 180 top
U$26  57.9,81.3 0 top
U$27  57.9,5.7 0 top
U$28  106.68,50.16 270 top
U$29  106.68,55.88 270 top
U$30  123.82,65.09 90 top
VCC  123.19,80.01 180 top

### Tracks (layer width: path | path; a pad name or v marks a point on that pad's centre or on a via)
12V  (via drill 0.5 pad 2.18)
  Top 0.406: 25.08,24.13 25.08,44.45 50.16,44.45 50.16,70.8 53.66,70.8 | 53.66,70.8 4.7K.2 | v53.66,74.61 53.66,70.8 | R16.1 29.21,28.26
  Top 0.61: C17.1 10.16,16.19 v10.16,18.41 12.7,18.41 12.7,24.13 25.08,24.13 26.99,24.13 U$21.P$1 27.3,28.26 29.21,28.26 IC4.6
  Bottom 0.305: +12V+12V.2 68.26,81.28
  Bottom 0.61: v10.16,18.41 U$8.+12 | 68.26,84.45 73.3,84.45 +12V+12V.1 | 68.26,81.28 68.26,84.45 | 68.26,84.45 53.66,84.45 v53.66,74.61
18B20  (via drill 0.5 pad 2.18)
  Top 0.305: IC1.12 70.54,58.05 v71.75,57.78
  Bottom 0.254: 1WIRE.2 110.49,81.28
  Bottom 0.61: v71.75,57.78 71.75,69.85 101.6,69.85 101.6,76.2 110.49,76.2 | 110.49,76.2 110.49,81.28 | 110.49,76.2 115.53,76.2 1WIRE.1
!RST
  Top 0.254: JP1.1 86.04,58.1 75.25,58.1 | IC2.7 75.88,46.61
  Top 0.305: 75.25,58.1 75.25,50.8 | 75.25,50.8 75.25,50.48 75.88,49.85 75.88,46.61 | 004.2 75.25,50.8
+3V3  (via drill 0.5 pad 2.18)
  Top 0.254: IC2.9 73.34,45.61 | 005.1 62.55,35.88 | 62.55,35.88 62.55,34.29 | U$7.16 66.99,37.47 62.55,37.47 62.55,35.88 | IC2.48 76.14,57.47 | IC2.36 82.23,49.61 82.23,51.44 | C11.1 86.36,20.32 85.12,20.32 | 85.12,20.32 IC5.2 | 85.12,20.32 85.09,20.32 C10.1 | IC2.1 72.07,49.61
  Top 0.305: 76.14,57.47 82.23,57.47 82.23,51.44 v84.46,51.44 | v84.46,42.23 84.46,40.64 | 84.46,40.64 81.64,40.64 IC2.24 | 84.46,40.64 94.3,40.64 94.3,41.91 JP4.9 | IC5.4 85.09,27.3 80.65,27.3 80.65,25.4 65.41,25.4 65.41,29.21 62.55,29.21 62.55,34.29 006.1 | 72.07,45.61 72.07,49.61 72.07,50.8 004.1 | U$7.16 66.99,45.4 72.07,45.4 72.07,45.61 | 73.34,45.61 72.07,45.61
  Top 0.61: IC5.4 96.2,27.28 U$20.P$1 99.38,25.08 99.38,41.91 JP4.9
  Bottom 0.61: v84.46,51.44 v84.46,42.23
+5V  (via drill 0.5 pad 2.18)
  Top 0.254: 87.4,21.27 IC5.3 | C4.1 89.53,20.27 89.53,21.27
  Top 0.305: R13.1 57.47,58.05 IC1.9 62.87,58.05 62.87,56.52 59.05,56.52 59.05,55.88 | 59.05,55.88 59.05,49.21 61.28,49.21 | R12.1 R25.1 | R28.2 104.16,60.01 | 104.16,60.01 R12.1 | R29.2 104.16,58.42 104.16,60.01 | R12.1 103.5,61.59 103.5,66.99 | 103.5,66.99 v100.33,66.99 | C7.1 103.5,68.26 103.5,66.99 | C3.1 59.05,55.88
  Top 0.406: U$6.4 82.23,67.63 | 82.23,67.63 88.26,67.63 | 98.43,67.63 92.39,67.63 | 92.39,67.63 U$3.4 | C5.1 88.26,67.63 | 88.26,67.63 92.39,67.63 | JP4.11 100.65,44.45 100.65,42.91 C8.2 102.23,42.39 | 82.23,67.63 80.33,67.63 C2.1
  Top 0.61: C6.1 98.43,67.63 98.43,66.99 | v100.33,66.99 98.43,66.99 | 98.43,66.99 98.43,59.37 73.98,59.37 73.98,52.39 JP2.4 69.53,49.21 61.28,49.21 61.28,27.62 | U$12.P$2 102.23,42.39 102.23,21.27 89.53,21.27 87.4,21.27 | 61.28,27.62 63.5,27.62 63.5,20.64 U$19.P$1 66.36,22.86 81.6,22.86 81.6,24.13 87.4,24.13 IC5.3 | IC6.3 53.98,27.62 61.28,27.62
  Bottom 0.305: VCC.2 120.69,75.88 120.65,75.88
  Bottom 0.61: VCC.1 125.69,75.88 120.69,75.88 | VCC.2 120.69,74.3 104.46,74.3 104.46,66.99 v100.33,66.99
+7V
  Top 0.406: 49.21,35.88 29.84,35.88 R17.2
  Top 0.61: L3.2 47.94,25.98 47.94,33.66 U$17.P$1 49.21,35.88 58.74,35.88 IC6.1
DIFF_RX  (via drill 0.5 pad 2.18)
  Top 0.254: IC1.3 55.88,61.95 v55.88,61.91 | R40.1 70.48,47.31 v65.72,47.31
  Bottom 0.61: v55.88,61.91 55.88,46.99 65.72,46.99 v65.72,47.31
DIFF_TX  (via drill 0.5 pad 2.18)
  Top 0.254: IC1.2 59.05,62.6 59.05,64.13 v53.66,64.13 | R38.1 v63.5,44.45
  Bottom 0.61: v53.66,64.13 53.66,44.77 63.5,44.77 v63.5,44.45
DIMM_IN_1
  Top 0.305: IC1.10 56.51,57.4 56.51,37.78 32.38,37.78 | R3.2 32.38,37.78 | R4.1 32.38,39.05 32.38,37.78
DIMM_IN_2
  Top 0.254: 51.43,58.42 51.43,66.04 60.01,66.04 60.01,63.25 IC1.1
  Top 0.305: R7.2 53.34,46.37 51.43,46.37 | 51.43,46.37 51.43,58.42 | R14.1 51.43,46.37
DM
  Top 0.254: IC2.32 83.14,47.62 85.41,47.62 91.44,53.66 91.81,53.97 JP3.2
DP
  Top 0.254: IC2.33 84.94,48.11 89.85,53.02 89.85,55.56 JP3.1
FAN_PWM  (via drill 0.5 pad 2.18)
  Top 0.305: U$1.3
  Top 0.406: v63.18,74.61 U$1.3 4.7K.1
  Bottom 0.305: v63.18,74.61 63.14,74.93
  Bottom 0.61: 63.14,74.93 GND_PWM.1
GND  (via drill 0.5 pad 2.18)
  Top 0.254: 78.14,53.66 IC2.44 78.14,49.53 | IC2.47 76.64,49.53 | 76.64,49.53 76.64,46.11 | 76.64,46.11 IC2.8 | 78.14,49.53 76.64,49.53 | 78.14,49.53 80.96,49.53 80.96,49.11 IC2.35 | 76.64,46.11 77.15,46.11 81.14,46.11 IC2.23 | U$7.1 U$7.2 U$7.3 | U$7.8 75.88,28.89 | 106.68,49.21 105.73,49.21 | C10.2 85.09,17.46 | C11.2 86.36,17.46 | C4.2 89.22,17.46 | 103.82,49.21 103.82,44.93 U$12.P$1 | R41.2 106.68,62.86
  Top 0.305: 35.24,43.5 30.8,43.5 OK1.2 | 35.24,43.5 43.18,43.5 | 43.18,43.5 OK2.2 | 59.05,59.35 IC1.7 63.82,59.35 63.82,55.88 60.01,55.88 60.01,50.16 64.45,50.16 JP2.2 | 59.05,59.35 C1.2 | U$3.1 96.2,71.44 | 96.2,71.44 96.2,73.34 | U$3.2 94.93,71.44 96.2,71.44 | U$6.1 86.04,71.44 | 59.05,59.35 54.61,59.35 54.61,55.88 | 37.15,29.54 38.78,29.54 38.46,29.53 IC4.4 | 64.13,69.53 58.1,69.53 | 58.1,69.53 v58.1,74.61 | 10K.1 58.1,68.26 58.1,69.53 | U$6.2 84.77,71.44 86.04,71.44 | 86.04,71.44 86.04,73.34 v88.26,73.34 | C3.2 54.61,55.88 | U$15.2 104.35,66.36 R15.1 106.68,66.36 | 106.68,66.36 106.68,62.86 106.68,54.93 | 106.68,54.93 106.68,49.21 U$28.2 | U$28.2 | 106.68,54.93 U$29.2 103.82,54.93 R33.2 | U$28.2 103.82,49.21 R34.2 | C7.2 106.68,68.26 106.68,66.36 | 75.88,28.89 75.88,27.62 | 75.88,27.62 v78.42,27.62 | R39.2 74.93,42.86 77.15,45.08 77.15,46.11 | 78.14,53.66 78.42,53.66 JP1.4 | C15.1 37.15,31.43 | 75.88,27.62 69.53,27.62 U$7.3 | 43.18,43.5 47.62,43.5 | 47.62,43.5 54.61,43.5 54.61,55.88 | U$2.C 35.24,41.59 35.24,43.5 | U$5.C 47.62,41.59 47.62,43.5
  Top 0.406: v15.24,18.41 15.19,18.41 arc-90 15.24,18.36 | 15.24,16.19 C17.2 | U$17.P$2 31.43,33.66 R18.1 | JP4.13 102.23,46.99 102.23,44.93 U$12.P$1 | 37.15,31.43 38.16,31.43 IC4.4 | 43.18,29.53 38.78,29.53 38.78,29.54 | U$1.2 78.42,68.37 78.42,68.26 | U$1.2 | U$1.2 64.13,69.53
  Top 0.61: C6.2 v98.43,73.34 96.2,73.34 96.2,75.25 88.26,75.25 | C5.2 v88.26,73.34 88.26,75.25 | 43.18,15.24 43.18,29.53 43.18,33.66 U$17.P$2 | 15.24,18.36 15.24,16.19 15.24,15.24 27.3,15.24 | 27.3,15.24 34.93,15.24 | 34.93,15.24 43.18,15.24 | 43.18,15.24 56.51,15.24 56.51,17.46 | 27.3,15.24 U$21.P$2 | v82.87,17.46 85.09,17.46 86.36,17.46 89.22,17.46 U$20.P$2 104.14,17.46 104.14,40.96 109.54,40.96 109.54,44.93 U$12.P$1 | IC5.1 82.87,20.98 v82.87,17.46 | 88.26,75.25 80.33,75.25 | 80.33,75.25 78.42,75.25 78.42,68.26 v78.42,65.09 | 102.23,44.93 C8.1 | C2.2 80.33,75.25 | IC6.2 56.51,17.46 | U$16.A 34.93,15.24 | 56.51,17.46 73.98,17.46 | 73.98,17.46 U$19.P$2 | v82.87,17.46 73.98,17.46
  Bottom 0.305: v88.26,73.34 88.22,73.34 | v98.43,73.34 98.38,73.34 | v58.1,74.61 58.14,74.61 | 130.81,81.28 GND.2
  Bottom 0.61: 88.22,73.34 +_TC2_-.1 | 98.38,73.34 +_TC1_-.1 98.38,84.14 130.81,84.14 | v15.24,18.41 U$8.GND | 58.14,74.61 GND_PWM.2 | 130.81,84.14 130.81,81.28 | GND.1 135.85,84.14 130.81,84.14 | JP1.4 v78.42,27.62 78.42,17.46 v82.87,17.46 | JP2.2 64.45,55.24 JP1.4 | JP1.4 v78.42,65.09
ISO_5V
  Top 0.254: 122.24,53.34 122.24,46.67 | 122.24,46.35 122.24,46.67 | 122.24,46.67 C9.2 119.06,46.67 119.06,37.31 U$12.P$5
  Top 0.305: 122.24,60.01 R20.1 R10.1 | 122.24,60.01 122.24,53.34 R19.1 R11.1 | U$4.8 129.86,68.58 117.47,68.58 117.47,60.96 122.24,60.96 | 122.24,60.96 122.24,60.01 | R30.1 122.87,62.55 122.87,60.96 122.24,60.96
ISO_GND
  Top 0.254: 125.73,49.85 125.73,48.26 125.68,46.67 C9.1 123.77,45.4 120.65,45.4 120.65,36.19 107.31,36.19 107.31,37.31 U$12.P$4
  Top 0.305: 125.73,56.52 125.73,62.55 123.82,62.55 123.82,66.04 U$30.2 126.68,66.04 R35.2 | 125.73,56.52 125.73,54.93 | 125.73,54.93 125.73,49.85 U$13.2 124.46,49.85 124.46,48.58 R9.2 | U$14.2 123.82,56.52 | R8.2 123.82,54.93 123.82,56.52 | 123.82,56.52 125.73,56.52 | U$4.5 133.67,64.77 132.4,64.77 U$4.3 132.4,59.05 128.59,59.05 128.59,54.93 125.73,54.93
MAX7765(1)_!CS
  Top 0.305: IC1.14 70.48,59.35 70.48,60.64 93.66,60.64 U$3.6
MAX7765(2)_!CS
  Top 0.305: 83.5,63.82 U$6.6 83.5,62.6 IC1.19
MAX7765_CLK
  Top 0.305: IC1.15 69.85,60 69.85,61.27 92.39,61.27 U$3.5 92.39,66.04 82.23,66.04 U$6.5
MAX7765_OUT  (1 unrouted)
  Top 0.305: IC1.17 69.22,61.3 69.22,61.94 84.77,61.94 U$6.7 84.77,65.41 89.85,65.41 | U$3.7 94.93,66.67 89.85,66.67
N$1  (via drill 0.5 pad 2.18)
  Top 0.305: U$3.3 v93.66,73.34
  Bottom 0.305: v93.66,73.34 93.38,73.34
  Bottom 0.61: 93.38,73.34 +_TC1_-.2
N$2
  Top 0.305: OK1.1 28.26,37.78 R3.1
N$3
  Top 0.305: R4.2 38.1,39.05 38.1,41.59 U$2.A
N$4
  Top 0.305: U$1.1 62.23,68.26 | 62.23,68.26 62.23,66.99 100.2 | 10K.2 62.23,68.26
N$6
  Top 0.254: JP4.4 70.8,34.29 U$7.4
N$7
  Top 0.813: OK1.4 33.34,48.58 23.18,48.58 R2.2
  Bottom 1.27: T1.G R2.2
N$8
  Top 0.813: OK1.6 26.35,51 R1.1
N$9  (via drill 0.5 pad 2.18)
  Top 0.305: U$6.3 v83.5,73.34
  Bottom 0.305: v83.5,73.34 83.22,73.34
  Bottom 0.61: 83.22,73.34 +_TC2_-.2
N$11
  Bottom 1.27: AC.2 2.22,81.28 2.22,49.85 U$8.N
  Bottom 2.54: LOAD1.2 45.72,81.28 45.72,85.41 30.44,85.41 | 30.44,85.41 LOAD.2 | AC.2 5.08,81.28 5.08,85.41 30.44,85.41
N$12
  Bottom 1.27: LOAD.1 25.4,81.28 25.4,72.39 23.18,72.39 R2.1 T1.T1
N$15
  Top 0.813: OK2.4 45.72,48.58 37.78,48.58 R6.1
  Bottom 1.27: R6.1 T2.G
N$16
  Top 0.813: R5.2 OK2.6
N$17
  Top 0.254: JP4.3 93.98,34.29 93.98,33.02 72.07,33.02 U$7.5
N$18
  Top 0.254: JP4.2 73.34,31.75 U$7.6
N$19
  Top 0.254: JP4.1 96.52,30.48 74.61,30.48 U$7.7
N$20
  Top 0.254: JP4.8 75.88,39.37 U$7.9
N$21
  Top 0.254: JP4.7 93.98,39.37 93.98,38.1 74.61,38.1 U$7.10
N$22
  Top 0.254: JP4.6 73.34,36.83 U$7.11
N$23
  Top 0.254: JP4.5 93.98,36.83 93.98,35.56 72.07,35.56 U$7.12
N$25
  Top 0.305: OK4.3 R22.2 R9.1
N$26
  Bottom 1.27: U$8.P 15.88,54.29 10.16,54.29 10.16,61.28 | 10.16,61.28 10.16,77.47 10.12,77.47 AC.1 | 10.16,61.28 T1.T2 26.35,61.28 | R1.2 26.35,61.28 | 26.35,61.28 T2.T2 40.64,61.28 R5.1
N$27
  Top 0.305: R8.1 121.59,55.88 | 121.59,55.88 R21.2 | OK5.3 121.59,55.88
N$28
  Top 0.305: IC1.8 59.05,58.7 C1.1
N$29
  Bottom 1.27: LOAD1.1 40.64,81.28 40.64,72.39 37.78,72.39 R6.2 T2.T1
N$33
  Top 0.305: OK2.1 40.64,39.05 53.34,39.05 R7.1
N$34
  Top 0.305: R14.2 51.43,41.59 U$5.A
N$36
  Top 0.305: R10.2 126.99,60.01 | 126.99,60.01 U$14.3 | 126.99,60.01 127,60.01 | 127,60.01 U$14.3 | U$4.2 131.13,60.01 127,60.01
N$37
  Top 0.305: R11.2 126.99,53.34 | 126.99,53.34 U$13.3 | U$4.4 133.67,58.1 129.54,58.1 129.54,53.34 126.99,53.34
N$38
  Top 0.305: R25.2 R27.2 107.31,62.55 OK3.4
N$40
  Top 0.305: OK3.3 R26.2 R15.2
N$41  (via drill 1 pad 2.18)
  other vias: 5,5.7
N$42
  Top 0.305: IC4.3 37.84,28.24
  Top 0.406: 37.84,28.24 35.24,28.26 35.24,31.43 C15.2
N$43
  Top 0.406: IC4.2 40.32,26.99 40.32,17.78 L3.1 39.29,18.41 34.93,18.41 U$16.C
N$44
  Top 0.406: 32.7,29.51 32.64,29.51 IC4.5 31.43,29.53 | 31.43,29.53 29.84,29.53 R17.1 | R18.2 31.43,29.53
N$45
  Top 0.406: IC4.1 IC4.8 IC4.7 31.43,26.99 31.43,26.4 R16.2
N$46
  Top 0.305: OK5.4 R24.2 R20.2
N$47
  Top 0.305: R19.2 121.59,52.7 | 121.59,52.7 R23.2 | OK4.4 121.59,52.7
N$48
  Top 0.305: R22.1 R23.1 U$13.1
N$49
  Top 0.305: U$14.1 R24.1 R21.1
N$50
  Top 0.305: R26.1 106.03,64.45 | 106.03,64.45 R27.1 | U$15.1 104.46,64.45 106.03,64.45
N$51
  Top 0.305: U$28.3 OK4.2
N$52
  Top 0.305: R30.2 OK3.1
N$53
  Top 0.305: U$30.3 OK3.2
N$54
  Top 0.305: OK4.1 112.71,52.7 112.71,60.01 R28.1
N$55
  Top 0.305: R31.1 129.86,61.91 U$4.1
N$56
  Top 0.305: OK5.1 R29.1
N$57
  Top 0.305: U$29.3 OK5.2
N$62
  Top 0.305: U$30.1 124.98,64.12 R35.1 126.68,61.91 R31.2
PWM
  Top 0.305: 100.1 68.26,66.99 68.26,63.25 IC1.20
RS485_A  (via drill 0.5 pad 2.18)
  Top 0.406: R32.1 132.66,69.16 132.4,68.9 U$4.6
  Top 0.61: v150.81,75.25 148.27,75.25 148.27,72.07 132.72,72.07 132.72,70.48 R32.1
  Bottom 0.254: v150.81,75.25 150.77,75.29
  Bottom 0.61: 150.77,75.29 +RS485-.1
RS485_B  (via drill 0.5 pad 2.18)
  Top 0.406: R32.2 130.86,69.16 131.13,68.9 U$4.7
  Top 0.61: v145.73,75.25 145.73,73.34 130.86,73.34 R32.2
  Bottom 0.254: v145.73,75.25 145.77,75.29
  Bottom 0.61: 145.77,75.29 +RS485-.2
RS485_DIR
  Top 0.254: IC2.29 86.75,46.11 90.49,49.85 100.97,49.85 R36.1
RS485_RX
  Top 0.254: IC2.31 85.84,47.11 89.85,51.12 99.38,51.12 99.38,57.78 102.23,57.78 102.23,65.41 | R41.1 102.23,62.86
  Top 0.305: U$15.3 102.23,65.41 102.23,62.86 102.23,61.59 R12.2
RS485_TX
  Top 0.254: IC2.30 86.3,46.61 90.17,50.48 100.01,50.48 100.01,51.12 R37.1
SCL
  Top 0.254: 006.2 69.53,34.29 U$7.14 69.53,40.64 80.64,40.64 IC2.22
SDA
  Top 0.254: 005.2 68.26,35.88 U$7.15 68.26,41.27 80.14,41.27 IC2.21
SPI_MISO
  Top 0.254: IC2.27 88.9,45.11 88.9,44.45 JP4.12
SPI_MOSI
  Top 0.254: IC2.28 88.9,45.61 88.9,46.99 JP4.14 92.71,46.99
SPI_SCK
  Top 0.254: IC2.26 88.26,44.61 88.26,41.91 JP4.10
STM8_!RST
  Top 0.305: R13.2 57.47,61.3 IC1.4 64.77,61.3 64.77,54.93 61.91,54.93 JP2.1
STM8_SWIM
  Top 0.305: IC1.18 65.72,61.95 65.72,55.24 66.99,55.24 JP2.3
STM32_RX
  Top 0.254: R38.2 69.22,44.45 69.22,42.86 | 69.22,42.86 R39.1 | IC2.13 76.14,41.91 69.22,41.91 69.22,42.86
STM32_TX
  Top 0.254: IC2.12 70.48,44.11 R40.2
SWCLK
  Top 0.254: IC2.37 81.64,53.02 80.96,53.02 JP1.3
SWDIO
  Top 0.254: JP1.2 83.5,53.02 87,53.02 87,51.12 84.49,48.61 IC2.34
~RS485_DIR
  Top 0.254: R36.2 100.97,56.83 103.82,56.83
  Top 0.305: U$29.1 103.82,56.83 R33.1
~RS485_TX
  Top 0.254: R37.2 101.6,51.44 101.6,51.12 103.82,51.12 R34.1
  Top 0.305: U$28.1 103.82,51.11 R34.1